# Altium project SC_generator.PrjPcb
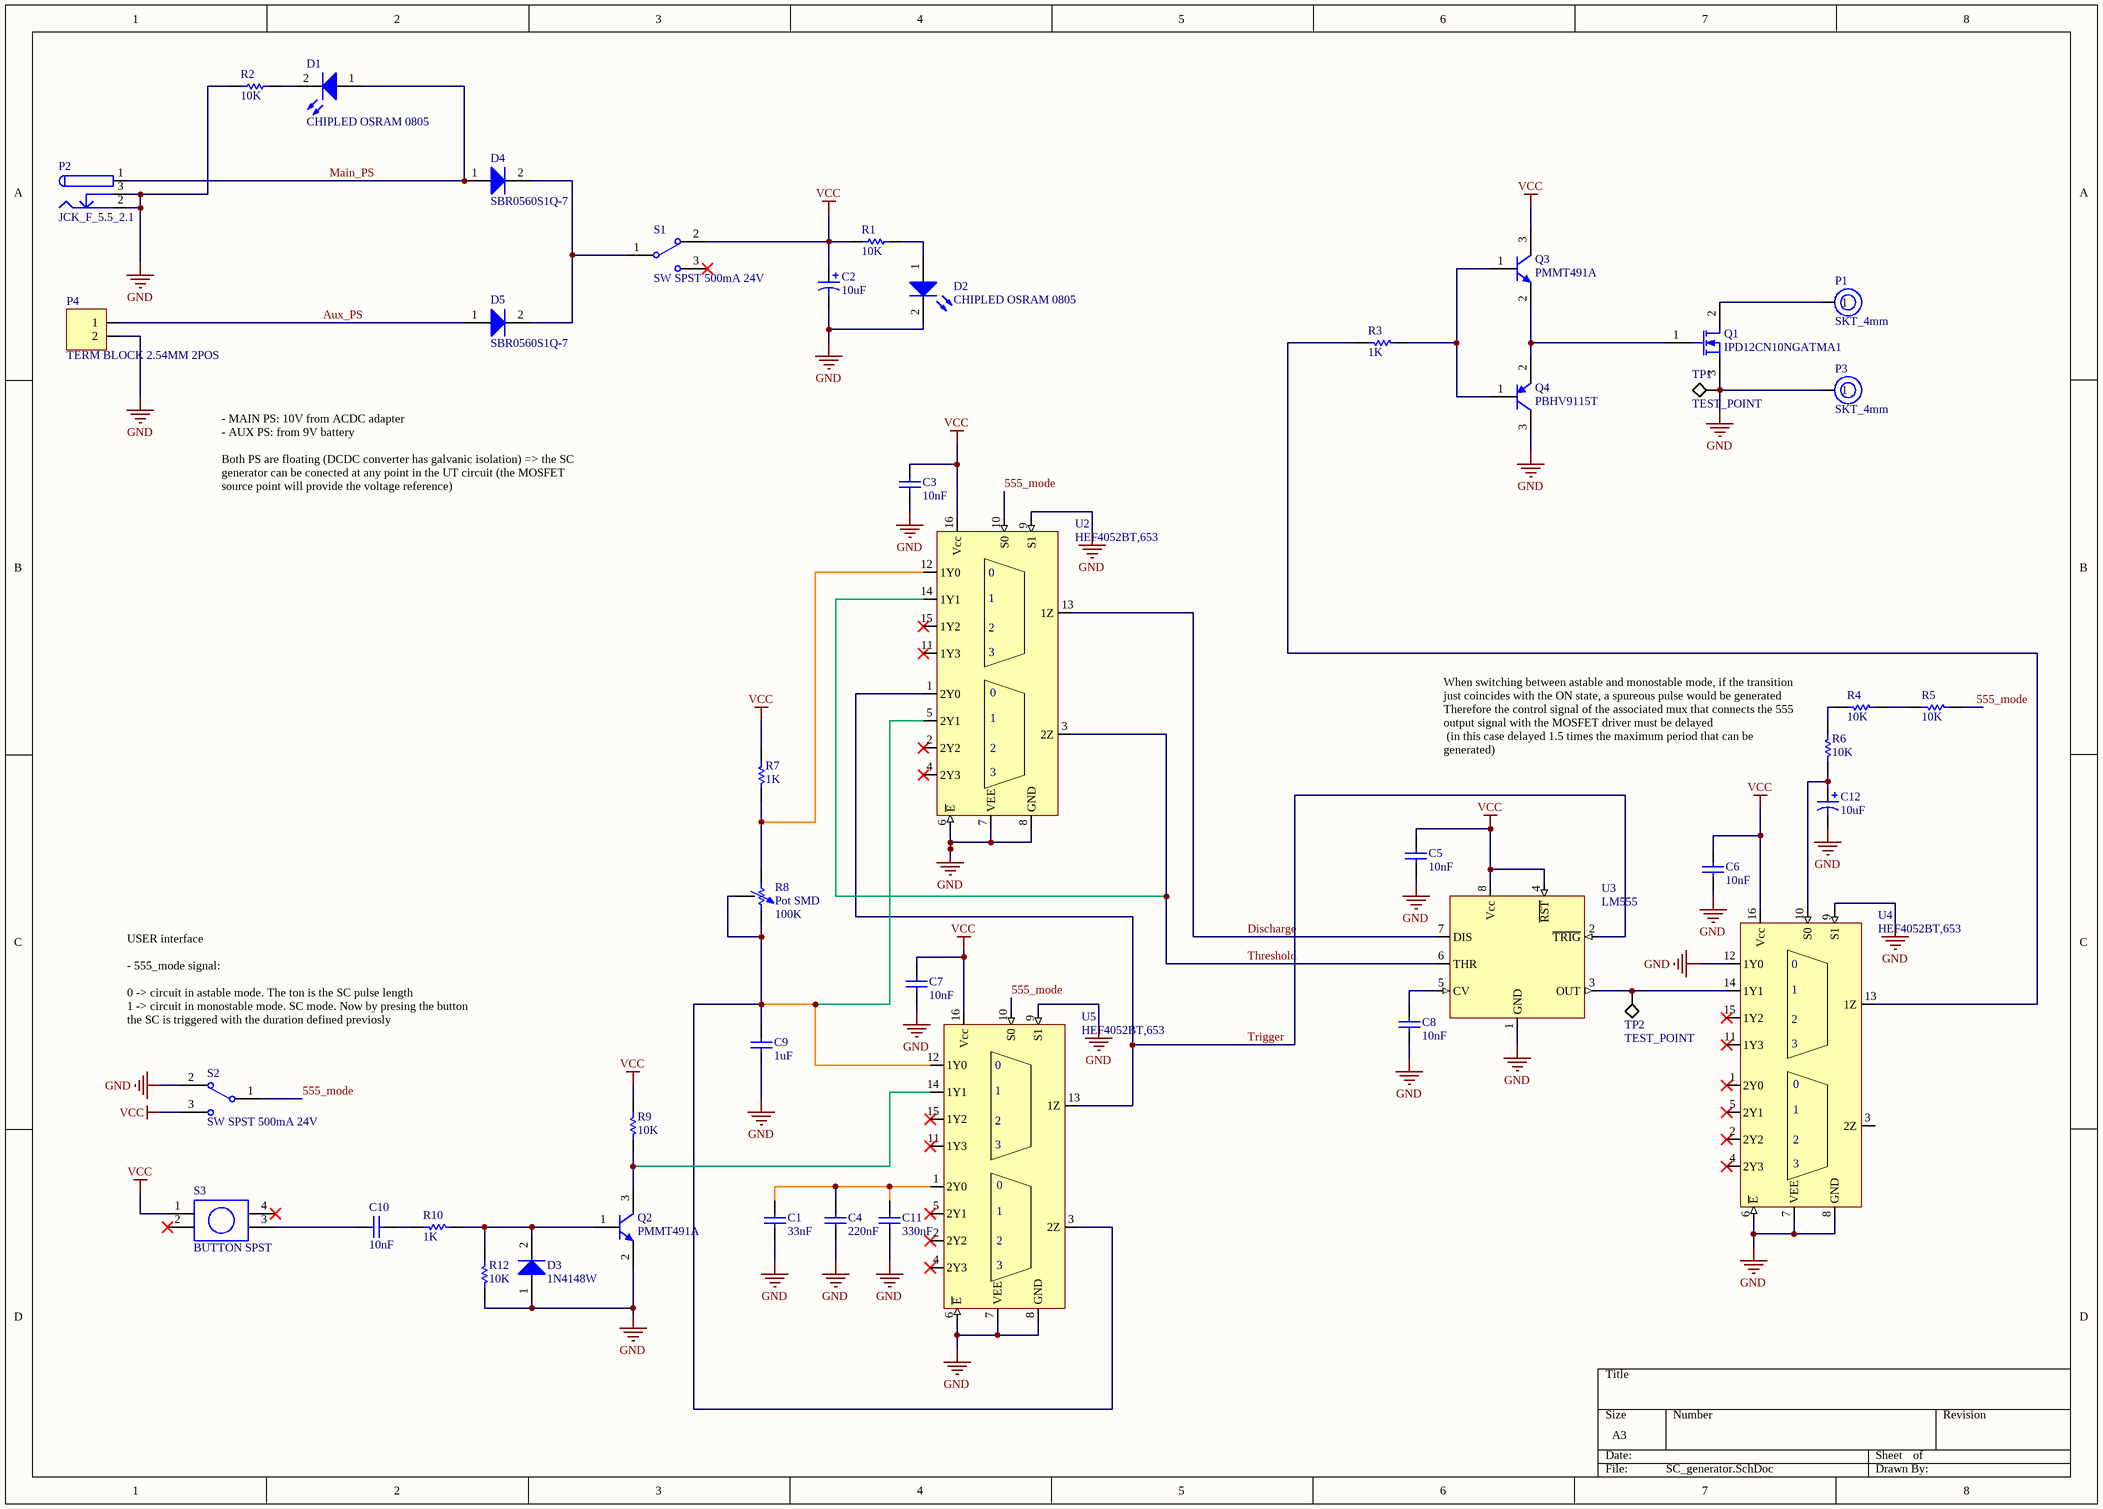
[diagram p0: SC_generator.SchDoc]
1 sheet, 45 parts. Net scope: global (net labels, ports and power ports of the same name join across sheets).
Board file: SC_generator.PcbDoc

## Sheet SC_generator.SchDoc
size A3

### Parts
C1  value 33nF  [CAP_0805_L]  (hidden comment: Cap Semi)
C2  value 10uF  [CAPAE5043X55M]  (hidden comment: Cap Electrol)
C3  value 10nF  [CAP_0805_L]  (hidden comment: Cap Semi)
C4  value 220nF  [CAP_0805_L]  (hidden comment: Cap Semi)
C5  value 10nF  [CAP_0805_L]  (hidden comment: Cap Semi)
C6  value 10nF  [CAP_0805_L]  (hidden comment: Cap Semi)
C7  value 10nF  [CAP_0805_L]  (hidden comment: Cap Semi)
C8  value 10nF  [CAP_0805_L]  (hidden comment: Cap Semi)
C9  value 1uF  [CAP_0805_L]  (hidden comment: Cap Semi)
C10  value 10nF  [CAP_0805_L]  (hidden comment: Cap Semi)
C11  value 330nF  [CAP_0805_L]  (hidden comment: Cap Semi)
C12  value 10uF  [CAPAE5043X55M]  (hidden comment: Cap Electrol)
D1  CHIPLED OSRAM 0805  [CHIPLED_0805_N]
D2  CHIPLED OSRAM 0805  [CHIPLED_0805_N]
D3  1N4148W  [SOD-123_M]
D4  SBR0560S1Q-7  [SOD-123_M]
D5  SBR0560S1Q-7  [SOD-123_M]
P1  SKT_4mm  [4MM SAFETY JACK]
P2  JCK_F_5.5_2.1  [PJ-059A]
P3  SKT_4mm  [4MM SAFETY JACK]
P4  TERM BLOCK 2.54MM 2POS  [TERM BLOCK 2.54MM 2POS]
Q1  IPD12CN10NGATMA1  [TO-252/DPAK]
Q2  PMMT491A  [SOT-23]
Q3  PMMT491A  [SOT-23]
Q4  PBHV9115T  [SOT-23]
R1  value 10K  [RES_1206_N]  (hidden comment: Res semi)
R2  value 10K  [RES_1206_N]  (hidden comment: Res semi)
R3  value 1K  [RES_1206_N]  (hidden comment: Res semi)
R4  value 10K  [RES_1206_N]  (hidden comment: Res semi)
R5  value 10K  [RES_1206_N]  (hidden comment: Res semi)
R6  value 10K  [RES_1206_N]  (hidden comment: Res semi)
R7  value 1K  [RES_1206_N]  (hidden comment: Res semi)
R8  Pot SMD  value 100K  [3361P_POT]
R9  value 10K  [RES_1206_N]  (hidden comment: Res semi)
R10  value 1K  [RES_1206_N]  (hidden comment: Res semi)
R12  value 10K  [RES_1206_N]  (hidden comment: Res semi)
S1  SW SPST 500mA 24V  [DIP_3x1_slide_switch]
S2  SW SPST 500mA 24V  [DIP_3x1_slide_switch]
S3  BUTTON SPST  [BUTTON SPDT]
TP1  TEST_POINT  [TP_SMD_pin]
TP2  TEST_POINT  [TP_SMD]
U2  HEF4052BT,653  [SO16_M]
U3  LM555  [SO-8_M]
U4  HEF4052BT,653  [SO16_M]
U5  HEF4052BT,653  [SO16_M]

### Nets
GND: C1.1 C2.2 C3.1 C4.1 C5.1 C6.1 C7.1 C8.1 C9.1 C11.1 C12.2 D2.2(K) D3.1(A) P2.2(sleeve) P2.3(connector_detec) P3.1 P4.2 Q1.3(S) Q2.2(E) Q4.3(C) R2.1 R12.1 S2.2 TP1.1 U2.6(~{E}) U2.7(VEE) U2.8(GND) U2.9(S1) U3.1(GND) U4.6(~{E}) U4.7(VEE) U4.8(GND) U4.9(S1) U4.12(1Y0) U5.6(~{E}) U5.7(VEE) U5.8(GND) U5.9(S1)
VCC: C2.1 C3.2 C5.2 C6.2 C7.2 Q3.3(C) R1.2 R7.2 R9.2 S1.2 S2.3 S3.1(A1) U2.16(Vcc) U3.4(~{RST}) U3.8(Vcc) U4.16(Vcc) U5.16(Vcc)
555_mode: R5.1 S2.1(C) U2.10(S0) U5.10(S0)
Aux_PS: D5.1(A) P4.1
Discharge: U2.13(1Z) U3.7(DIS)
Main_PS: D1.1(A) D4.1(A) P2.1(tip)
Threshold: U2.3(2Z) U2.14(1Y1) U3.6(THR)
Trigger: U2.1(2Y0) U3.2(~{TRIG}) U5.13(1Z)
NetC1_2: C1.2 C4.2 C11.2 U5.1(2Y0)
NetC8_2: C8.2 U3.5(CV)
NetC9_2: C9.2 R8.2 R8.3 U2.5(2Y1) U5.3(2Z) U5.12(1Y0)
NetC10_1: C10.1 S3.3(B2)
NetC10_2: C10.2 R10.2
NetC12_1: C12.1 R6.1 U4.10(S0)
NetD1_2: D1.2(K) R2.2
NetD2_1: D2.1(A) R1.1
NetD3_2: D3.2(K) Q2.1(B) R10.1 R12.2
NetD4_2: D4.2(K) D5.2(K) S1.1(C)
NetP1_1: P1.1 Q1.2(D)
NetQ1_1: Q1.1(G) Q3.2(E) Q4.2(E)
NetQ2_3: Q2.3(C) R9.1 U5.14(1Y1)
NetQ3_1: Q3.1(B) Q4.1(B) R3.1
NetR3_2: R3.2 U4.13(1Z)
NetR4_1: R4.1 R5.2
NetR4_2: R4.2 R6.2
NetR7_1: R7.1 R8.1 U2.12(1Y0)
NetTP2_1: TP2.1 U3.3(OUT) U4.14(1Y1)

Not connected (* = marked no-connect by the designer): S1 3*; S3 2(A2)* 4(B1)*; U2 2(2Y2)* 4(2Y3)* 11(1Y3)* 15(1Y2)*; U4 1(2Y0)* 2(2Y2)* 3(2Z) 4(2Y3)* 5(2Y1)* 11(1Y3)* 15(1Y2)*; U5 2(2Y2)* 4(2Y3)* 5(2Y1)* 11(1Y3)* 15(1Y2)*

### Notes on the sheet
- - MAIN PS: 10V from ACDC adapter
  - AUX PS: from 9V battery
  Both PS are floating (DCDC converter has galvanic isolation) => the SC generator can be conected at any point in the UT circuit (the MOSFET source point will provide the voltage reference)
- (near R6) When switching between astable and monostable mode, if the transition just coincides with the ON state, a spureous pulse would be generated
  Therefore the control signal of the associated mux that connects the 555 output signal with the MOSFET driver must be delayed
  (in this case delayed 1.5 times the maximum period that can be generated)
- (near S2) USER interface
  - 555_mode signal:
  0 -> circuit in astable mode. The ton is the SC pulse length
  1 -> circuit in monostable mode. SC mode. Now by presing the button the SC is triggered with the duration defined previosly
- (in symbol HEF4052BT,653) 0

### Library data of the parts
C1 C3-C11 = Cap Semi: Generic ceramic capacitor
C2 C12 = Cap Electrol: Generic electrolitic capacitor
D1 D2 = CHIPLED 0805: Referencia RS: 497-4804; Mfr1: OSRAM
D3 = 1N4148W: Diodo de conmutación, 1N4148W-E3-08, 150mA, 75V, SOD-123, 2-Pines, Maximum of 50; Mfr 1: Vishay; Referencia RS: 700-3671
D4 D5 = SBR0560S1Q-7: Diodo Súper barrera Montaje en superficie 60V 500 mA SOD-123; Mfr 1: Diodes Incorporated; Referencia Digi-key: SBR0560S1Q-7DICT-ND
P1 P3 = SKT_4mm: Conector hembra de 4 mm Hirschmann 930176101, 30 V ac, 60 V dc, 32A, Rojo, Latón, Estaño, Hembra, Soldadura, 23.5mm; Mfr1: Hirschmann Test & Measurement; Referencia RS: 738-480
P2 = jack_female_5.5_2.1: Power Barrel Connector Jack 2.10mm ID (0.083"), 5.50mm OD (0.217") Through Hole, Right Angle; Mfr1: CUI Inc.; Referencia Digi-key: CP-059A-ND
P4 = TERM BLOCK 2.54MM 2POS: 2 Position Wire to Board Terminal Block Horizontal with Board 0.100" (2.54mm) Through Hole; Mfr1: Phoenix Contact; Referencia Digi-key: 277-1273-ND
Q1 = IPD12CN10NGATMA1: Canal N Montaje en superficie 100V 67 A (Tc) 125 W (Tc) PG-TO252-3; Mfr1: Infineon Technologies; Referencia Digi-Key: IPD12CN10NGATMA1CT-ND
Q2 Q3 = PMMT491A: Transistor de Unión Bipolar Único, NPN, 40 V, 250 mW, 1 A, 300 hFE; Mfr 1: NEXPERIA; Referencia Farnell: 8738157
Q4 = PBHV9115T: Transistor de Unión Bipolar Único, PNP, -150 V, 115 MHz, 300 mW, -1 A, 220 hFE; Mfr1: NEXPERIA; Referencia Farnell: 1829319
R1-R7 R9 R10 R12 = Res semi: Generic resistor
R8 = Pot SMD: Generic pot SMD; Mfr1: BOURNS; Referencia Digi-Key: 3361P-103GLFCT-ND
S1 S2 = SW SPST TH: Interruptor SIP, SPST, Pasante, Actuador Deslizante, 500 mA a 24 V
S3 = BUTTON SPST: Interruptor táctil tipo Botón, Negro, contactos SPST-NA, Montaje superficial; Mfr1: TE Connectivity; Referencia RS: 479-1508
TP1 TP2 = TEST_POINT: Generic test point, several footprints
U2 U4 U5 = HEF4052BT,653: IC MUX/DEMUX DUAL 4X1 16SOIC; Mfr: Nexperia; Digi-key reference: 1727-6411-1-ND
U3 = LM555: IC OSC SINGLE TIMER